# Altium schematic sheet Main_PLL.SchDoc: FIT_PM12 board
size 420 x 297 mm; CheckedBy: G.Kasprowicz; Author: INR Moscow; CompanyName: WUT ISE; DrawnBy: M.Podgórski; Organization: WUT ISE; Address1: PW ISE; Address2: Nowowiejska 15/19 00-665 Warsaw; Address3: gkasprow@gmail.com; DocumentNumber: 9; Revision: 2; SheetNumber: 2; SheetTotal: 21; ModifiedBy: -; CheckedDate: -; Title2: Clocking; DivGrp: WUT ISE; Designer: INR RAS; ModifiedDate: -; ProjectName: Sensor Box
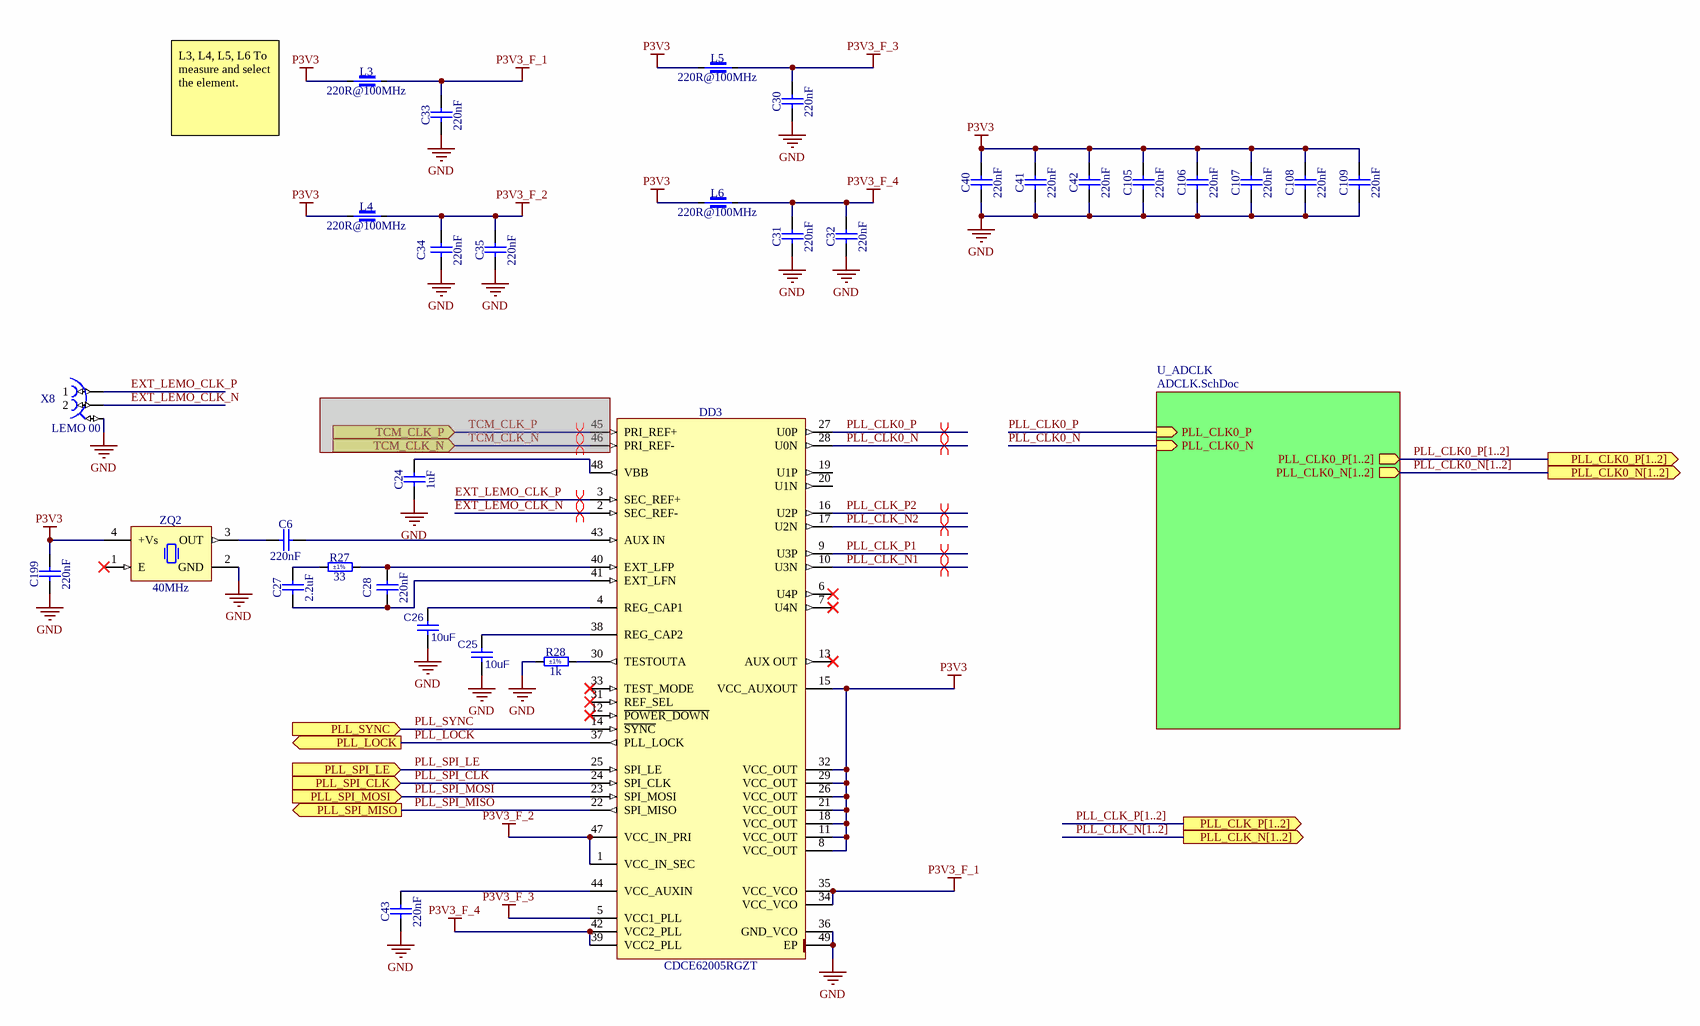
[diagram p0: Main_PLL.SchDoc]

## Parts
C6  220nF  [CAPC1005X55N]
C24  1uF  [CAPC2012X140N]
C25  10uF  [CAPC1005X70N]
C26  10uF  [CAPC1005X70N]
C27  2.2uF  [CAPC2012X140N]
C28  220nF  [CAPC2012X135N]
C30  220nF  [CAPC2012X135N]
C31  220nF  [CAPC2012X135N]
C32  220nF  [CAPC2012X135N]
C33  220nF  [CAPC2012X135N]
C34  220nF  [CAPC2012X135N]
C35  220nF  [CAPC2012X135N]
C40  220nF  [CAPC1005X55N]
C41  220nF  [CAPC1005X55N]
C42  220nF  [CAPC1005X55N]
C43  220nF  [CAPC2012X135N]
C105  220nF  [CAPC1005X55N]
C106  220nF  [CAPC1005X55N]
C107  220nF  [CAPC1005X55N]
C108  220nF  [CAPC1005X55N]
C109  220nF  [CAPC1005X55N]
C199  220nF  [CAPC2012X135N]
DD3  CDCE62005RGZT  [QFN50P700X700X100-49N-S570]
L3  220R@100MHz  [INDC2012X105N]
L4  220R@100MHz  [INDC2012X105N]
L5  220R@100MHz  [INDC2012X105N]
L6  220R@100MHz  [INDC2012X105N]
R27  33  Tolerance: ±1%  [RESC1005X40N]
R28  1k  Tolerance: ±1%  [RESC1005X40N]
X8  LEMO 00  [LEMO_EPG.00.302.NLN]
ZQ2  40MHz  [OSC_IQD_CFPS-73]

## Sub-sheets
U_ADCLK = ADCLK.SchDoc: PLL_CLK0_P[1..2] (out), PLL_CLK0_N[1..2] (out), PLL_CLK0_P (in), PLL_CLK0_N (in)

## Ports
PLL_CLK0_N[1..2] (out), PLL_CLK0_P[1..2] (out), PLL_CLK_N[1..2] (out), PLL_CLK_P[1..2] (out), PLL_LOCK (out), PLL_SPI_CLK (in), PLL_SPI_LE (in), PLL_SPI_MISO (out), PLL_SPI_MOSI (in), PLL_SYNC (in), TCM_CLK_N (in), TCM_CLK_P (in)

## Nets
GND: C24.1 C25.1 C26.1 C30.1 C31.1 C32.1 C33.1 C34.1 C35.1 C40.1 C41.1 C42.1 C43.1 C105.1 C106.1 C107.1 C108.1 C109.1 C199.1 DD3.36(GND_VCO) DD3.49(EP) R28.1 X8.3 ZQ2.2(GND)
P3V3: C40.2 C41.2 C42.2 C105.2 C106.2 C107.2 C108.2 C109.2 C199.2 DD3.8(VCC_OUT) DD3.11(VCC_OUT) DD3.15(VCC_AUXOUT) DD3.18(VCC_OUT) DD3.21(VCC_OUT) DD3.26(VCC_OUT) DD3.29(VCC_OUT) DD3.32(VCC_OUT) L3.1 L4.1 L5.1 L6.1 ZQ2.4(+Vs)
P3V3_F_1: C33.2 DD3.34(VCC_VCO) DD3.35(VCC_VCO) L3.2
P3V3_F_2: C34.2 C35.2 DD3.1(VCC_IN_SEC) DD3.47(VCC_IN_PRI) L4.2
P3V3_F_3: C30.2 DD3.5(VCC1_PLL) L5.2
P3V3_F_4: C31.2 C32.2 DD3.39(VCC2_PLL) DD3.42(VCC2_PLL) L6.2
EXT_LEMO_CLK_N: DD3.2(SEC_REF-) X8.2
EXT_LEMO_CLK_P: DD3.3(SEC_REF+) X8.1
PLL_CLK0_N: DD3.28(U0N) ; sheet U_ADCLK/PLL_CLK0_N
PLL_CLK0_P: DD3.27(U0P) ; sheet U_ADCLK/PLL_CLK0_P
PLL_CLK_N1: DD3.10(U3N)
PLL_CLK_N2: DD3.17(U2N)
PLL_CLK_P1: DD3.9(U3P)
PLL_CLK_P2: DD3.16(U2P)
PLL_LOCK: DD3.37(PLL_LOCK) ; port PLL_LOCK
PLL_SPI_CLK: DD3.24(SPI_CLK) ; port PLL_SPI_CLK
PLL_SPI_LE: DD3.25(SPI_LE) ; port PLL_SPI_LE
PLL_SPI_MISO: DD3.22(SPI_MISO) ; port PLL_SPI_MISO
PLL_SPI_MOSI: DD3.23(SPI_MOSI) ; port PLL_SPI_MOSI
PLL_SYNC: DD3.14(~{SYNC}) ; port PLL_SYNC
NetC6_1: C6.1 ZQ2.3(OUT)
NetC6_2: C6.2 DD3.43(AUX_IN)
NetC24_2: C24.2 DD3.48(VBB)
NetC25_2: C25.2 DD3.38(REG_CAP2)
NetC26_2: C26.2 DD3.4(REG_CAP1)
NetC27_1: C27.1 C28.1 DD3.41(EXT_LFN)
NetC27_2: C27.2 R27.1
NetC28_2: C28.2 DD3.40(EXT_LFP) R27.2
NetC43_2: C43.2 DD3.44(VCC_AUXIN)
NetDD3_30: DD3.30(TESTOUTA) R28.2

Not connected (* = marked no-connect by the designer): DD3 6(U4P)* 7(U4N)* 12(~{POWER_DOWN})* 13(AUX_OUT)* 19(U1P) 20(U1N) 31(REF_SEL)* 33(TEST_MODE)* 45(PRI_REF+) 46(PRI_REF-); ZQ2 1(E)*

## Buses and harness runs
bus PLL_CLK0_N[1..2] = port PLL_CLK0_N[1..2] = sheet U_ADCLK/PLL_CLK0_N[1..2]
bus PLL_CLK0_P[1..2] = port PLL_CLK0_P[1..2] = sheet U_ADCLK/PLL_CLK0_P[1..2]
bus PLL_CLK_N[1..2] = port PLL_CLK_N[1..2]
bus PLL_CLK_P[1..2] = port PLL_CLK_P[1..2]

## Layout directives
differential pair: (no net found under the mark), EXT_LEMO_CLK_N, EXT_LEMO_CLK_P, PLL_CLK0_N, PLL_CLK0_P, PLL_CLK_N1, PLL_CLK_N2, PLL_CLK_P1, PLL_CLK_P2

## Notes on the sheet
- L3, L4, L5, L6 To measure and select the element.
- Project/Equipment
- Document
- Designer
- Drawn by
- Check.by
- Copyright WUT ISE 2024.
  This documentation describes Open Hardware and is licensed under the CERN OHL-W v.2.0. You may redistribute and modify this documentation under the terms of the CERN OHL-W v.2.0. (http://ohwr.org/CERNOHL). This documentation is distributed WITHOUT ANY EXPRESS OR IMPLIED WARRANTY, INCLUDING OF MERCHANTABILITY, SATISFACTORY QUALITY AND FITNESS FOR A PARTICULAR PURPOSE. Please see the CERN OHL v.2.0 for applicable conditions.
- Contact
- File
- Last Mod.
- Print Date
- Sheet
- Size
- A3
- of
- Rev

## Library data of the parts
C6 C40-C42 C105-C109 = CC0402_220NF_16V_10%_X7R: Non-polarised capacitor; Part Description: SMD Multilayer Chip Ceramic Capacitor; Manufacturer: GENERIC; Manufacturer1 Part Number: C1005X7R1C224K050; Voltage: 16V; TC: X7R; Tolerance: ±10%; Part Number: CC0402_220NF_16V_10%_X7R; Component Kind: Standard; Component Type: Standard; Pin Count: 2; Value: 220nF; Status: Preferred; Manufacturer Part Number: CC0402_220NF_16V_10%_X7R; Case: 0402; Mounted: Yes; Socket: No; SMD: Yes; Sense: No; Manufacturer1 Example: TDK; Manufacturer1 ComponentHeight: 0.55mm; HelpURL: \\cern.ch\dfs\Applications\Altium\Datasheets\CC0402_X7R_TDK_C.pdf; Author: CERN DEM JLC; CreateDate: 25.10.2012; LatestRevisionDate: 25.10.2012
C24 = CC0805_1UF_25V_10%_X7R: Non-polarised capacitor; Part Description: SMD Multilayer Chip Ceramic Capacitor; Manufacturer: GENERIC; Manufacturer1 Part Number: C0805C105K3RAC; Voltage: 25V; TC: X7R; Tolerance: ±10%; Part Number: CC0805_1UF_25V_10%_X7R; Component Kind: Standard; Component Type: Standard; Pin Count: 2; Value: 1uF; Status: Preferred; Manufacturer Part Number: CC0805_1UF_25V_10%_X7R; Case: 0805; Mounted: Yes; Socket: No; SMD: Yes; Sense: No; Manufacturer1 Example: KEMET; Manufacturer1 ComponentHeight: 1.4mm; HelpURL: \\cern.ch\dfs\Applications\Altium\Datasheets\CC0805_X7R_KEMET.pdf; Author: CERN DEM JLC; CreateDate: 23.03.2009; LatestRevisionDate: 23.03.2009
C25 C26 = CC0402_10UF_6.3V_20%_X5R: Non-polarised capacitor; Part Description: SMD Multilayer Chip Ceramic Capacitor; Manufacturer: GENERIC; Manufacturer1 Part Number: C1005X5R0J106M050BC; Voltage: 6.3V; TC: X5R; Tolerance: ±10%; Part Number: CC0402_10UF_6.3V_20%_X5R; Component Kind: Standard; Component Type: Standard; Pin Count: 2; Value: 10uF; Status: Preferred; Manufacturer Part Number: CC0402_10UF_6.3V_20%_X5R; Case: 0402; Mounted: Yes; Socket: No; SMD: Yes; Sense: No; Manufacturer1 Example: TDK; Manufacturer1 ComponentHeight: 0.70mm; HelpURL: \\cern.ch\dfs\Applications\Altium\Datasheets\CC0402_X5R_TDK_C.pdf; Author: CERN DEM JLC; CreateDate: 07.01.2015; LatestRevisionDate: 07.01.2015
C27 = CC0805_2.2UF_50V_10%_X7R: Non-polarised capacitor; Part Description: SMD Multilayer Chip Ceramic Capacitor; Manufacturer: GENERIC; Manufacturer1 Part Number: GRM21BR61H225KA73L; Voltage: 50V; TC: X7R; Tolerance: ±10%; Part Number: CC0805_2.2UF_50V_10%_X7R; Component Kind: Standard; Component Type: Standard; Pin Count: 2; Value: 2.2uF; Status: Preferred; Manufacturer Part Number: CC0805_2.2UF_50V_10%_X7R; Case: 0805; Mounted: Yes; Socket: No; SMD: Yes; Sense: No; Manufacturer1 Example: MURATA; Manufacturer1 ComponentHeight: 1.40mm; HelpURL: \\cern.ch\dfs\Applications\Altium\Datasheets\CC0805_X7R_MURATA_GRM.pdf; Author: CERN DEM JLC; CreateDate: 18.08.2014; LatestRevisionDate: 18.08.2014
C28 C30-C35 C43 C199 = CC0805_220NF_50V_10%_X7R: Non-polarised capacitor; Part Description: SMD Multilayer Chip Ceramic Capacitor; Manufacturer: GENERIC; Manufacturer1 Part Number: GRM21BR71H224KA01L; Voltage: 50V; TC: X7R; Tolerance: ±10%; Part Number: CC0805_220NF_50V_10%_X7R; Component Kind: Standard; Component Type: Standard; Pin Count: 2; Value: 220nF; Status: Preferred; Manufacturer Part Number: CC0805_220NF_50V_10%_X7R; Case: 0805; Mounted: Yes; Socket: No; SMD: Yes; Sense: No; Manufacturer1 Example: MURATA; Manufacturer1 ComponentHeight: 1.35mm; HelpURL: \\cern.ch\dfs\Applications\Altium\Datasheets\CC0805_X7R_MURATA.pdf; Author: CERN DEM JLC; CreateDate: 03.12.2007; LatestRevisionDate: 03.12.2007
DD3 = CDCE62005RGZT: 5/10 Outputs Clock Generator/Jitter Cleaner with Integrated Dual VCO; Manufacturer: TEXAS INSTRUMENTS; PressFit: No; Bonding: No; Part Number: CDCE62005RGZT; Component Kind: Standard; Component Type: Standard; Device: CDCE62005RGZT; PackageDescription: QFN, 0.50mm Pitch, Square; 48 Pin, 7.00mm L X 7.00mm W X 1.00mm H body (w/Thermal Tab 5.70 X 5.70mm), IPC Medium Density; Part Description: 5/10 Outputs Clock Generator/Jitter Cleaner with Integrated Dual VCO; Manufacturer Part Number: CDCE62005RGZ; Pin Count: 49; Case: QFN48; Mounted: Yes; Socket: No; SMD: Yes; Sense: No; ComponentHeight: 1mm; HelpURL: \\cern.ch\dfs\Applications\Altium\Datasheets\CDCE62005RGZT.pdf; Author: CERN DEM JLC; CreateDate: 21.11.2011; LatestRevisionDate: 10.06.2022
L3-L6 = IND0805_TDK_MPZ2012S221A: Part Description: SMT Chip Bead for General Power Line (MPZ Series); Manufacturer: TDK; Power: 3A; Resistance: 0.04R; Tolerance: ±25%; Part Number: IND0805_TDK_MPZ2012S221A; Component Kind: Standard; Component Type: Standard; Pin Count: 2; Value: 220R@100MHz; Manufacturer Part Number: MPZ2012S221A; Case: 0805; Mounted: Yes; Socket: No; SMD: Yes; Sense: No; ComponentHeight: 1.05mm; HelpURL: \\cern.ch\dfs\Applications\Altium\Datasheets\IND0805_TDK_MPZ2012.pdf; Author: CERN DEM HF; CreateDate: 04.10.2021; LatestRevisionDate: 04.10.2021
R27 = R0402_33R_1%_0.0625W_100PPM: Resistor - 1%; Part Description: General Purpose Thick Film Chip Resistor; Manufacturer: GENERIC; Manufacturer1 Part Number: 232270673309L; TC: ±100ppm/°C; PressFit: No; Part Number: R0402_33R_1%_0.0625W_100PPM; Component Kind: Standard; Component Type: Standard; Pin Count: 2; Value: 33; Status: Not Recommended; Power: 0.0625W; Manufacturer Part Number: R0402_33R_1%_0.0625W_100PPM; Case: 0402; Mounted: Yes; Sense: No; Socket: No; SMD: Yes; Manufacturer1 Example: YAGEO PHYCOMP; Manufacturer1 ComponentHeight: 0.4mm; HelpURL: \\cern.ch\dfs\Applications\Altium\Datasheets\R0402_Phycomp_RC0402.pdf; Author: CERN DEM JLC; CreateDate: 03.12.2007; LatestRevisionDate: 17.10.2012
R28 = R0402_1K_1%_0.0625W_100PPM: Resistor - 1%; Part Description: General Purpose Thick Film Chip Resistor; Manufacturer: GENERIC; Manufacturer1 Part Number: 232270671002L; TC: ±100ppm/°C; PressFit: No; Part Number: R0402_1K_1%_0.0625W_100PPM; Component Kind: Standard; Component Type: Standard; Pin Count: 2; Value: 1k; Status: Not Recommended; Power: 0.0625W; Manufacturer Part Number: R0402_1K_1%_0.0625W_100PPM; Case: 0402; Mounted: Yes; Sense: No; Socket: No; SMD: Yes; Manufacturer1 Example: YAGEO PHYCOMP; Manufacturer1 ComponentHeight: 0.4mm; HelpURL: \\cern.ch\dfs\Applications\Altium\Datasheets\R0402_Phycomp_RC0402.pdf; Author: CERN DEM JLC; CreateDate: 03.12.2007; LatestRevisionDate: 17.10.2012
X8 = LEMO_EPG.00.302.NLN: Part Description: Size 00, Elbow Socket (90°) with 2 Female Contacts and Alignment Key (G); PressFit: No; SCEM: 09.31.28.007.2; Part Number: LEMO_EPG.00.302.NLN; Component Kind: Standard; Component Type: Standard; Pin Count: 3; Family: LEMO 00; Mounted: Yes; Socket: No; SMD: No; Sense: No; Status: None; Manufacturer: LEMO; Manufacturer Part Number: EPG.00.302.NLN; ComponentHeight: 7mm; HelpURL: \\cern.ch\dfs\Applications\Altium\Datasheets\LEMO_EPG.00.302.NLN.pdf; Author: CERN DEM JLC; CreateDate: 25.08.2010; LatestRevisionDate: 20.12.2010
ZQ2 = OSC_40MHZ_IQD_LFSPXO018042: Oscillator 4 pins 1=E 2=GND 3=OUT 4=+Vs; Part Description: 3.3V, ±50ppm, 50pF, 0..70°C, HCMOS Surface Mount Clock Oscillator (CFPS-73 Series); Manufacturer: IQD FREQUENCY PRODUCTS; PressFit: No; Bonding: No; Part Number: OSC_40MHZ_IQD_LFSPXO018042; Component Kind: Standard; Component Type: Standard; PackageDescription: Oscillator, Side Concave, 5.08mm Pitch, 4 Pins, 5.00mm L X 7.00mm W X 1.40mm H, CFPS-73 Series; Value: 40MHz; Manufacturer Part Number: LFSPXO018042; Pin Count: 4; Mounted: Yes; Socket: No; SMD: Yes; Sense: No; ComponentHeight: 1.4mm; HelpURL: \\cern.ch\dfs\Applications\Altium\Datasheets\OSC_IQD_LFSPXO018042.pdf; Author: CERN DEM JLC; CreateDate: 22.08.2011; LatestRevisionDate: 03.11.2016